# EasyEDA schematic New Project.json
TITLE: Sheet_1; REV: 1.0; Date: 2026-09-05; Sheet: 1/1; Company: Your Company
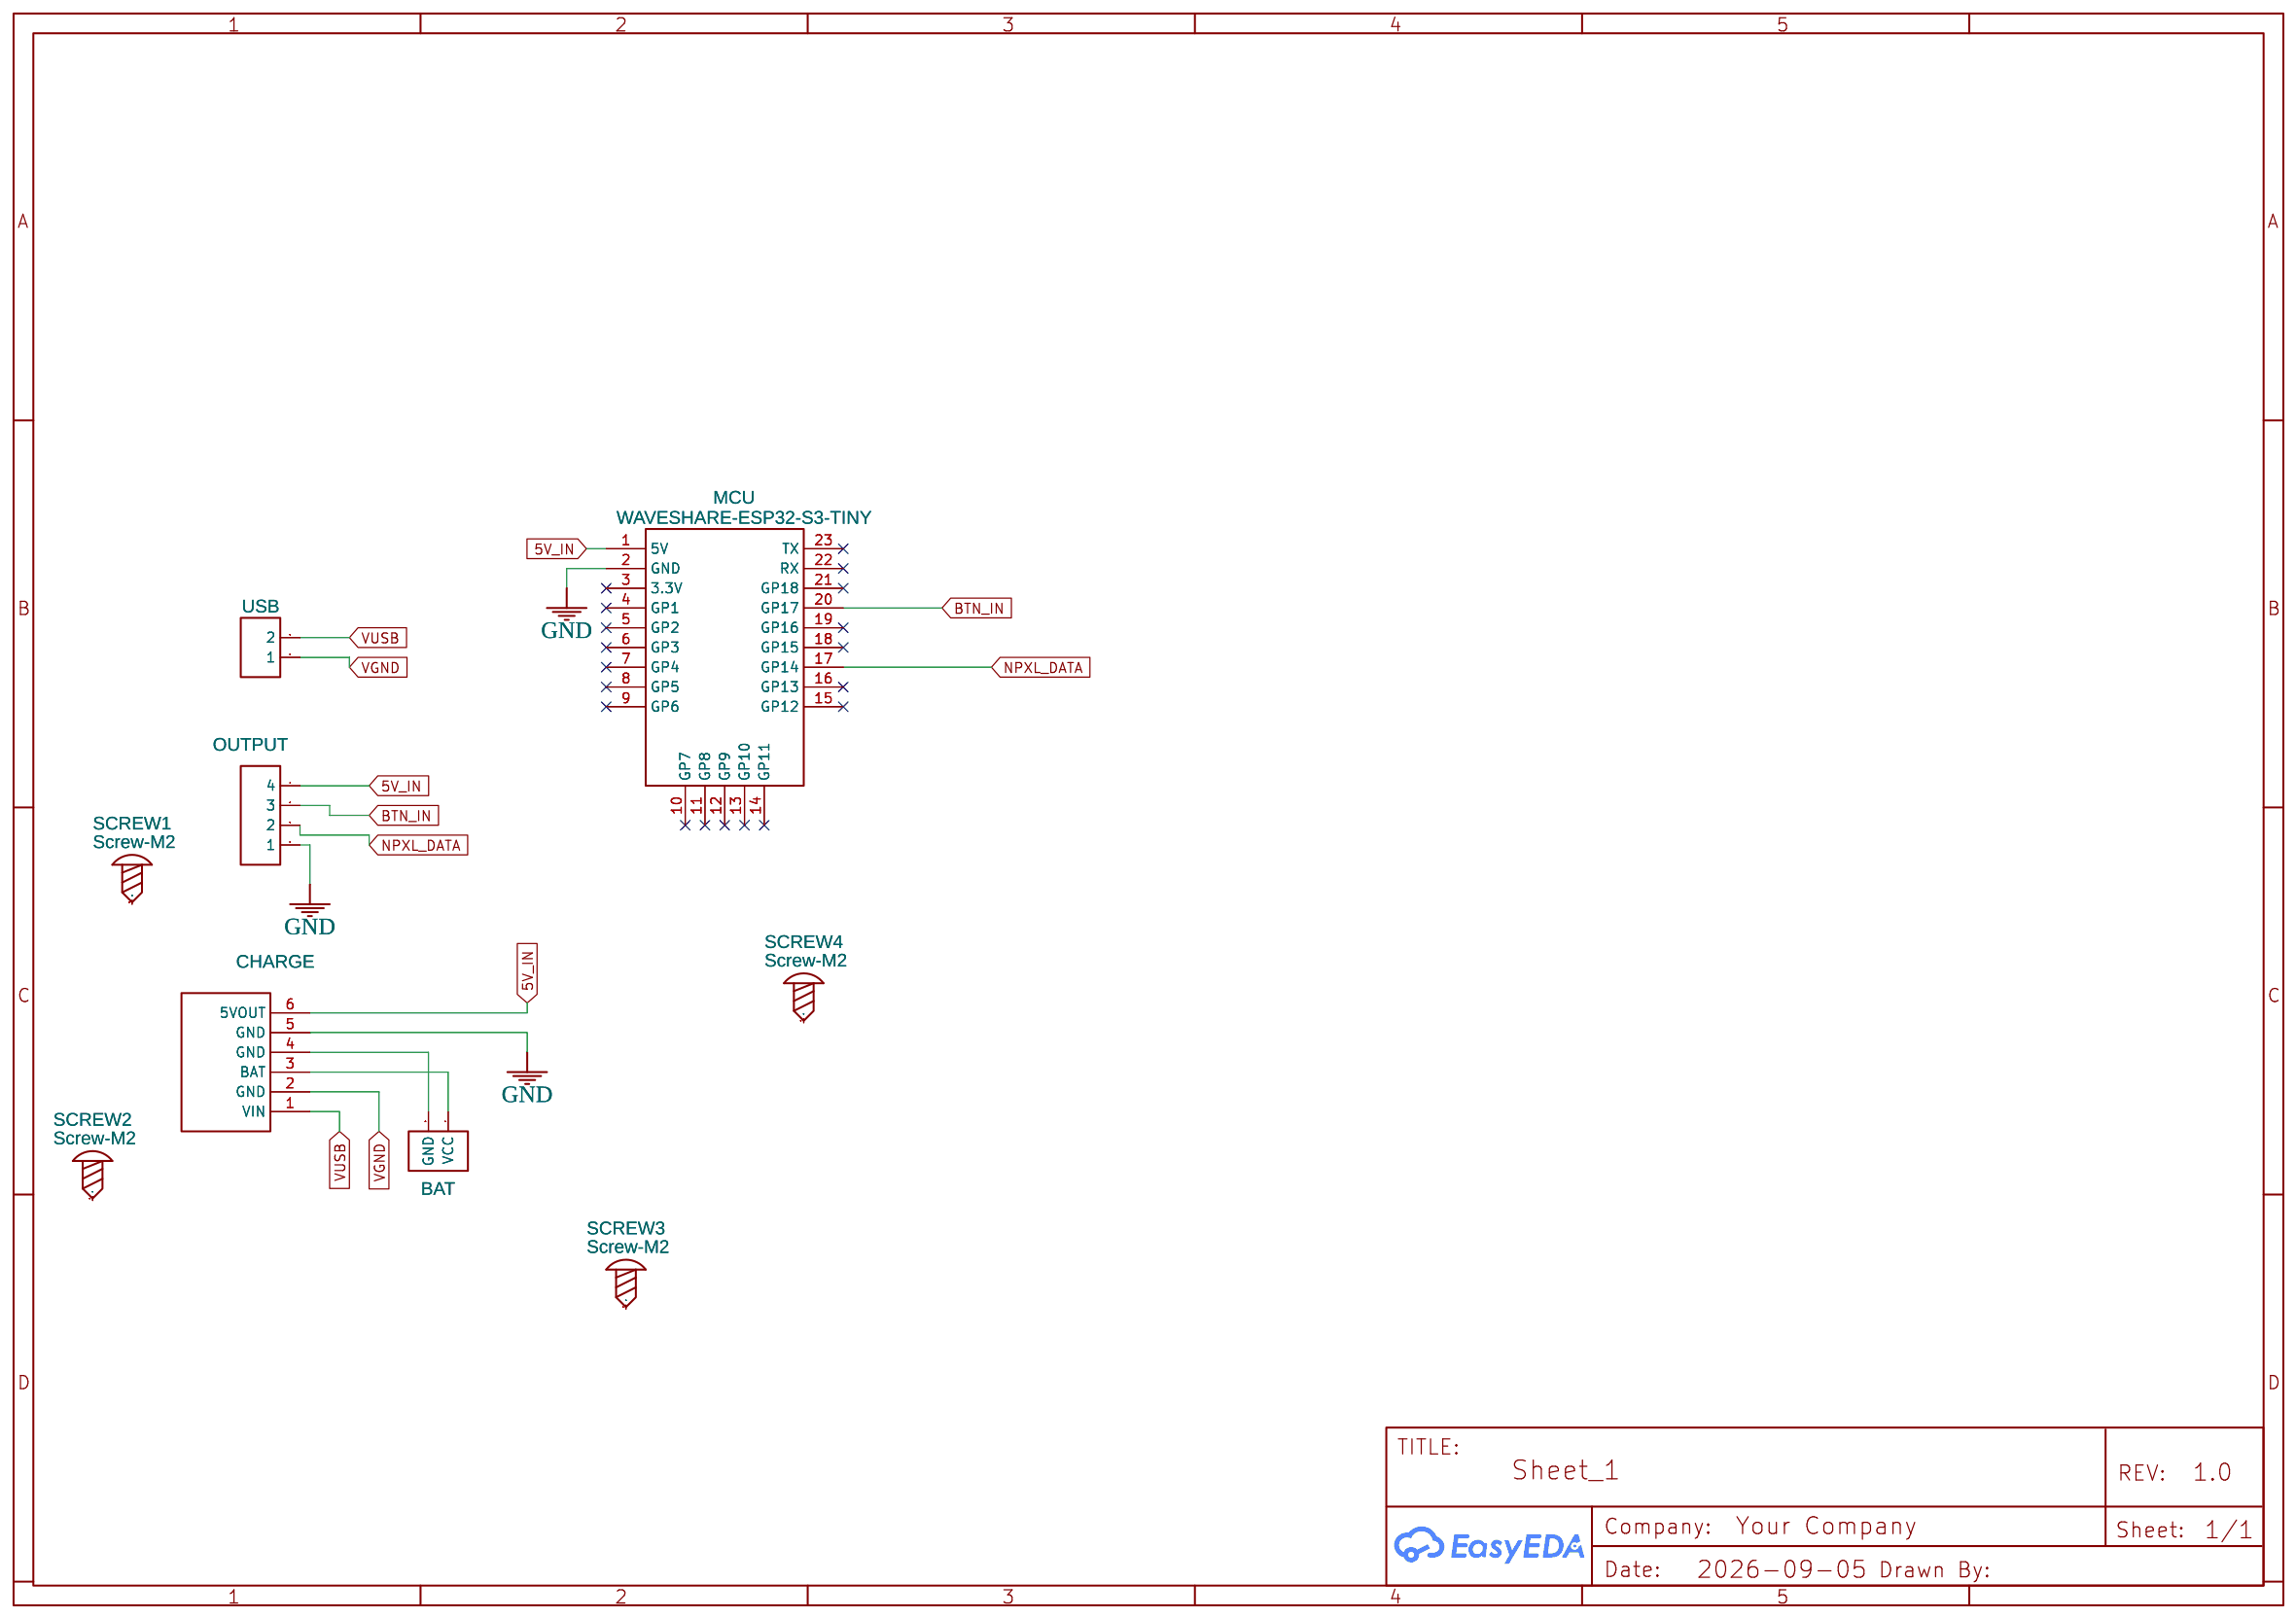
[diagram p0: schematic sheet]

## Parts
BAT  Input  [HDR-F-2.54_1X2]
CHARGE  2A_5V_CHARGE_DISCHARGE_INTEGRATED_3.7V_4.2V_LITHIUM_BATTERY_BOOST_WASN  [LITHIUM BATTERY CHARGE/DISCHARGE]
MCU  WAVESHARE-ESP32-S3-TINY  [WAVESHARE-ESP32-S3-TINY]
OUTPUT  output  [HDR-F-2.54_1X4]
SCREW1  Screw-M2  [SCREW-M2]
SCREW2  Screw-M2  [SCREW-M2]
SCREW3  Screw-M2  [SCREW-M2]
SCREW4  Screw-M2  [SCREW-M2]
USB  HDR-M-2.54_1x2  [HDR-M-2.54_1X2]

## Library data of the parts
BAT = HDR-F-2.54_1x2: Supplier Part: C49661; Supplier: LCSC; Contributor: LCEDA_Lib
CHARGE = 2A_5V_CHARGE_DISCHARGE_INTEGRATED_3.7V_4.2V_LITHIUM_BATTERY_BOOST_WASN: Manufacturer Part: 2A_5V_Charge_Discharge_Integrated_3.7V_4.2V_Lithium_Battery_Boost_Mobile; Contributor: Макс Селиванов
MCU = WAVESHARE-ESP32-S3-TINY: Manufacturer: WAVESHARE; Manufacturer Part: ESP32-S3 Mini Development Board; Supplier: WAVESHARE; link: https://www.waveshare.com/product/esp32-s3-tiny.htm; Contributor: Mohammed Jerjawi
OUTPUT = HDR-F-2.54_1x4: Supplier Part: C225501; Supplier: LCSC; Contributor: LCEDA_Lib
SCREW1-SCREW4 = Screw-M2: Contributor: EasyEDA
USB = HDR-M-2.54_1x2: Supplier Part: C124375; Supplier: LCSC; Contributor: LCEDA_Lib

## Nets
5V_IN: CHARGE.6(5VOUT) MCU.1(5V) OUTPUT.4
GND: CHARGE.5(GND) MCU.2(GND) OUTPUT.1
BTN_IN: MCU.20(GP17) OUTPUT.3
NPXL_DATA: MCU.17(GP14) OUTPUT.2
VGND: CHARGE.2(GND) USB.1
VUSB: CHARGE.1(VIN) USB.2
Net-(BAT-1): BAT.1(VCC) CHARGE.3(BAT)
Net-(BAT-2): BAT.2(GND) CHARGE.4(GND)

Not connected (* = marked no-connect by the designer): MCU 3(3.3V)* 4(GP1)* 5(GP2)* 6(GP3)* 7(GP4)* 8(GP5)* 9(GP6)* 10(GP7)* 11(GP8)* 12(GP9)* 13(GP10)* 14(GP11)* 15(GP12)* 16(GP13)* 18(GP15)* 19(GP16)* 21(GP18)* 22(RX)* 23(TX)*; SCREW1 1; SCREW2 1; SCREW3 1; SCREW4 1
